# Altium schematic sheet Sheet1.SchDoc (part 2 of 2)
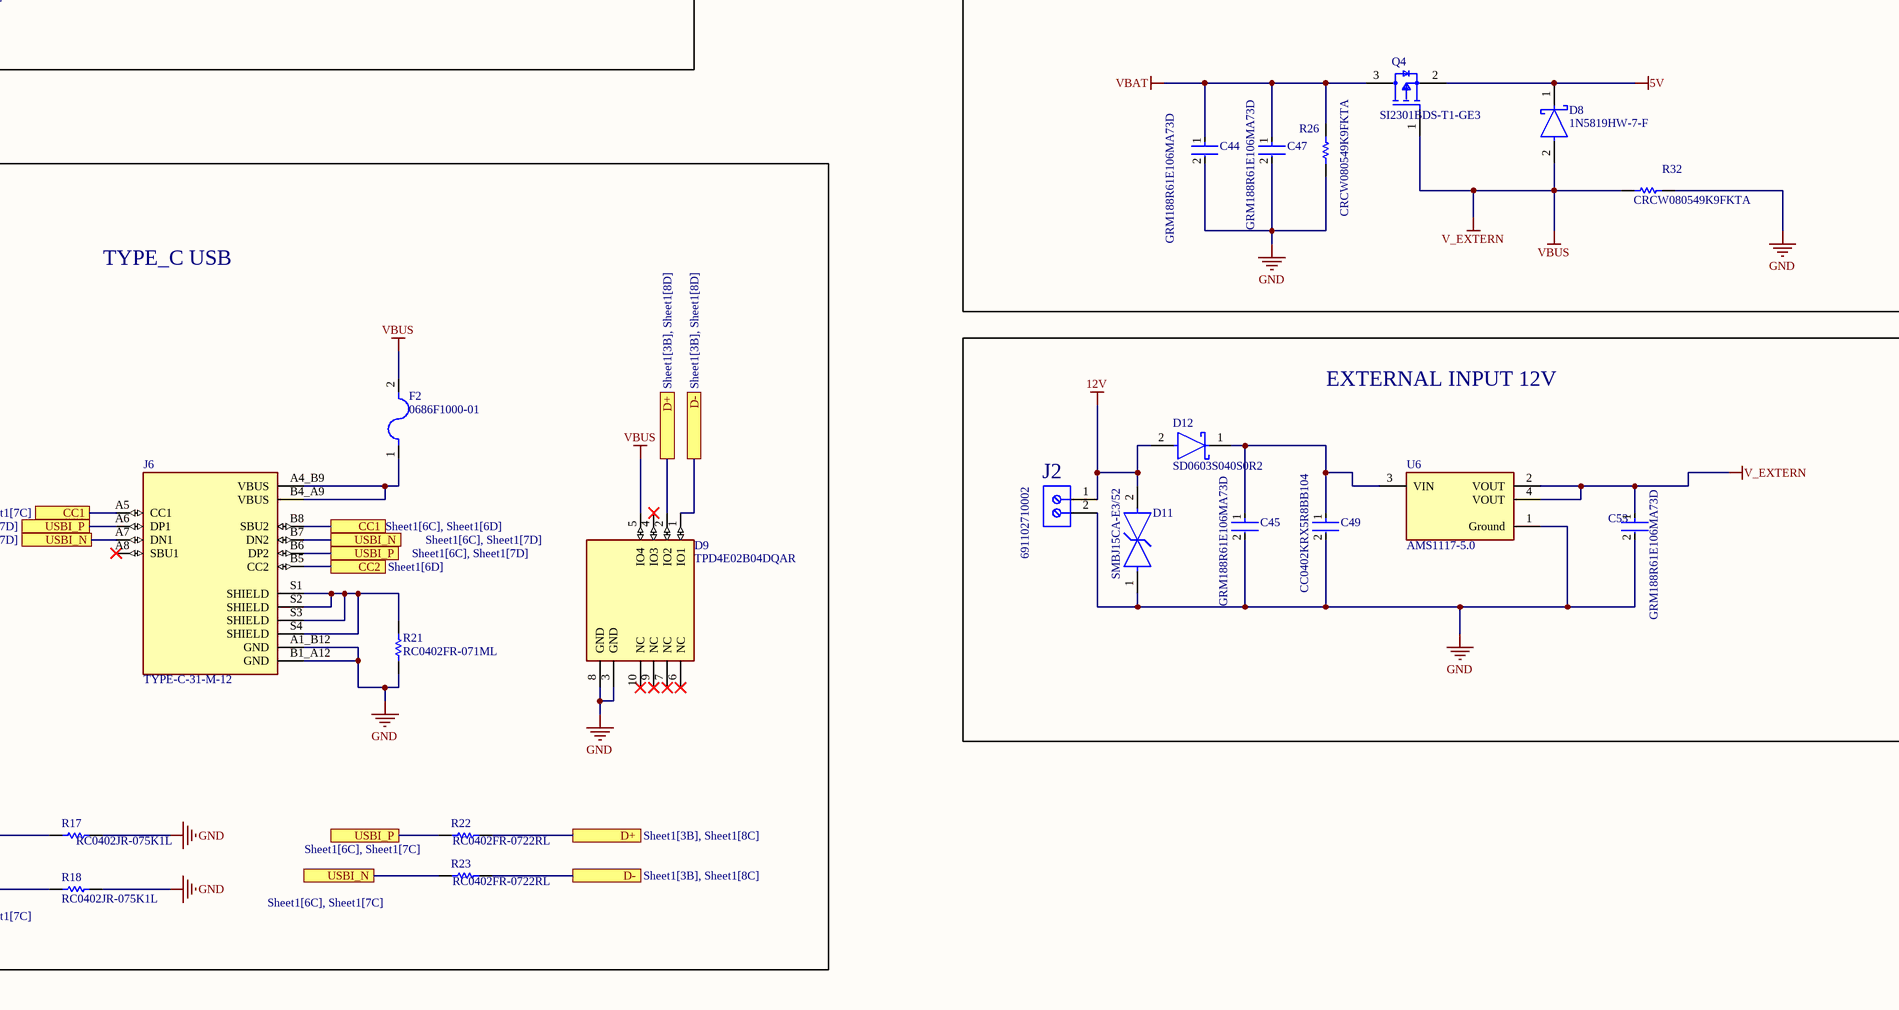
[diagram p4: Sheet1.SchDoc, bottom right]

## Library data of the parts
C1 = CMP-2008-03720-2: Ceramic Capacitor for Automotive 47nF ±10% 25VDC X7R 0402 Paper T/R; Voltage Rating: 25V; REACH SVHC: No SVHC; Width: 0.02inch; Packaging: Tape and Reel; Case Code (Metric): 1005; Radiation Hardening: No; Voltage: 25V; Length: 1mm; Capacitance: 47nF; Thickness: 0.022inch; Depth: 0.5mm; Termination: SMD/SMT; Dielectric: X7R; Case/Package: 0402; Ratings: AEC-Q200; Voltage Rating (DC): 25V; Mount: Surface Mount; Max Operating Temperature: 125°C; Package Quantity: 1; Tolerance: 10%; Min Operating Temperature: -55°C; Case Code (Imperial): 0402; Height: 0.5mm
C2 C33 = CMP-1662-00020-1: Chip Capacitor, 1 uF, +/- 10%, 6.3 V, -55 to 85 degC, 0402 (1005 Metric), RoHS, Tape and Reel; Voltage Rating (DC): 3 V; Type (Capacitors): X5R; Voltage Rating: 6.3 V; Capacitance: 1 uF; ComponentLink2Description: Datasheet; ComponentLink2URL: http://psearch.en.murata.com/capacitor/product/GRM155R60J105KE19%23.pdf; Max Operating Temperature: 85 degC; Min Operating Temperature: -55 degC; Package Quantity: 10000; Mounting Technology: Surface Mount; ComponentLink1Description: Manufacturer URL; ComponentLink1URL: http://www.murata.com/; PackageDescription: 2-Pin Surface Mount Device, Body 1 x 0.5 mm; Tolerance: 10%; Case/Package: 0402; Mount: Surface Mount; Packaging: Tape and Reel; Case Code (Metric): 1005; Radiation Hardening: No; Width: 0.5 mm; Length: 1 mm; DatasheetVersion: 08/2016; Height: 0.5 mm; PartNumber: GRM155R60J105KE19D; RoHSCompliant: true; Case Code (Imperial): 0402; REACH SVHC: No SVHC; Pins: 2
C4 = CMP-2008-03694-3: Ceramic Capacitor for Automotive 100pF ±5% 50VDC C0G 0402 Paper T/R; Voltage: 50V; Ratings: AEC-Q200; Radiation Hardening: No; Min Operating Temperature: -55°C; Capacitance: 100pF; Depth: 0.5mm; Max Operating Temperature: 125°C; Length: 1mm; Height: 0.5mm; Termination: SMD/SMT; Voltage Rating: 50V; Dielectric: C0G; Package Quantity: 10000; Case Code (Imperial): 0402; Width: 0.02inch; Case/Package: 0402; Lead Free: Lead Free; Case Code (Metric): 1005; Voltage Rating (DC): 50V; Thickness: 0.022inch; Mount: Surface Mount; Tolerance: 5%; REACH SVHC: No SVHC; Weight: 0.000212oz; Packaging: Tape and Reel
C5 = CMP-06035-013155-1: Ceramic Capacitor for Automotive 820pF ±5% 50VDC C0G 0402 Paper T/R
C8 C31 = CMP-2000-06332-1: Chip Capacitor, 10 nF, 16 V, 10%, -55 to 125 degC, 0402 (1005 Metric), RoHS, Tape and Reel; Manufacturer: Murata; Rated Voltage: 16V; Capacitance: 10000pF; Dielectric: X7R; Manufacturer URL: http://www.murata.com/; Package Description: 2-Pin Surface Mount Device, Body 1 x 0.5 mm; Case Size/Dimension: 0402; Tolerance (%): ±10%; Datasheet Version: 06/2016; Package Reference: 0402; Mounting Technology: SurfaceMount; Datasheet URL: http://psearch.en.murata.com/capacitor/product/GRM155R71C103KA01%23.pdf
C9 C13 C18 C19 C26-C30 C34 C35 C48-C50 C52 = CMP-03422-000607-1: CAP CER 0.1UF 25V X5R 0402; Manufacturer: YAGEO; Tolerance: 0.1; Value: 100 nF; Material: Ceramic; Automotive Grade: NA; Temperature Coefficient: 30ppm/°C; Height: 0.55mm; Voltage Rating: 25 V; Octopart: https://octopart.com/cc0402krx5r8bb104-yageo-20779263; Mouser Description: Multilayer Ceramic Capacitors MLCC - SMD/SMT 100nF 25V X5R 10%; Category: Cap; Lead Free: Yes; Device Class L2: Capacitors; Device Class L1: Passive Components; Digikey Description: CAP CER 0.1UF 25V X5R 0402; Device Class L3: Ceramic Capacitors; Temperature: -55°C to +125°C; Ipc Land Pattern Name: CAPC10050X50; Automotive: No; Package: CC0402; Temperature Range High: +125°C; RoHS: TRUE; ComponentLink2Description: Datasheet; Footprint Url: http://www.yageo.com/exep/pages/download/literatures/UPY-C_GEN_24.pdf; Capacitance: 100 nF; ComponentLink2URL: http://www.yageo.com/documents/recent/UPY-GP_NP0_16V-to-50V_16.pdf; Temperature Range Low: -55°C; Temperature Characteristic: X5R; Manufacturer Part Number: CC0402KRX5R8BB104
C11 C12 C15 C20 C21 = CMP-06035-003573-1: Chip Multilayer Ceramic Capacitors for General Purpose, 0402, 4.7uF, X5R, 15%, 20%, 10V; Case/Package: 0402; Voltage Rating: 10V; Min Operating Temperature: -55°C; Mount: Surface Mount; Packaging: Tape and Reel; Max Operating Temperature: 85°C; Capacitance: 4.7uF; Case Code (Metric): 1005; Case Code (Imperial): 0402; Tolerance: 20%
C14 C43 C51 = CMP-2000-06337-3: Chip Multilayer Ceramic Capacitors for General Purpose, 0603, 22uF, X5R, 15%, 20%, 10V; Tolerance: 20%; Weight: 0.000222oz; Material: Ceramic; Depth: 0.8mm; Length: 1.6mm; Termination: SMD/SMT; Capacitance: 22uF; Packaging: Tape and Reel; Width: 0.8mm; Voltage Rating: 10V; Case Code (Imperial): 0603; Mount: Surface Mount; Voltage Rating (DC): 10V; Case/Package: 0603; Thickness: 0.039inch; REACH SVHC: No SVHC; Dielectric: X5R; Height: 0.8mm; Package Quantity: 4000; Case Code (Metric): 1608; Min Operating Temperature: -55°C; Lead Free: Lead Free; Max Operating Temperature: 85°C
C16 C17 C?#1 C?#2 = CMP-2008-02740-1: Manufacturer: AVX Interconnect / Elco; Part Number: 04026A120KAT2A
C22 C23 = CMP-2008-03915-1: Manufacturer: Murata; Part Number: GRM1555C1H101JA01D
C24 C25 = CMP-2008-03799-2: Multi-Layer Ceramic Capacitor 12pF C0G  ±2% 0402 Paper T/R; Voltage Rating: 50V; Tolerance: 2%; Length: 1mm; Width: 0.5mm; Thickness: 0.022inch; Package Quantity: 10000; Lead Free: Lead Free; Mount: Surface Mount; Capacitance: 12pF; Voltage Rating (DC): 50V; Max Operating Temperature: 125°C; Termination: SMD/SMT; Depth: 0.5mm; Min Operating Temperature: -55°C; Height: 0.5mm; Case Code (Imperial): 0402; Case/Package: 0402; Case Code (Metric): 1005; Dielectric: C0G; Packaging: Tape and Reel; Radiation Hardening: No
C32 = CMP-2008-04600-1: Manufacturer: Murata; Part Number: GRM155R71C123KA01D
C36 = CMP-06035-062171-1: Ceramic Capacitor for Automotive 4pF ±0.25pF 50VDC C0G 0402 Paper T/R; Voltage Rating: 50V; Mount: Surface Mount; Min Operating Temperature: -55°C; Package Quantity: 10000; Case/Package: 0402; Case Code (Imperial): 0402; Thickness: 0.022inch; Dielectric: C0G; Length: 0.039inch; Ratings: AEC-Q200; Max Operating Temperature: 125°C; Voltage Rating (DC): 50V; Packaging: Tape and Reel; RoHS Compliant: Yes; Termination: SMD/SMT; Weight: 0.000212oz; Capacitance: 4pF; Case Code (Metric): 1005; Width: 0.02inch; Height: 0.5mm
C37 C38 = CMP-2008-04640-1: Manufacturer: Murata; Part Number: GRM155R71H122KA01D
C39 C40 = CMP-2008-03971-1: Manufacturer: Murata; Part Number: GRM1555C1E100JA01D
C41 = CMP-06035-005738-1: Ceramic Capacitor for Automotive 8pF ±0.25pF 50VDC C0G 0402 Paper T/R
C42 = CMP-2008-03956-2: Chip Multilayer Ceramic Capacitors for General Purpose, 0402, 0.47uF, X6S, 22%, 10%, 6.3V; Capacitance: 470nF; Termination: SMD/SMT; Voltage Rating (DC): 6.3V; Min Operating Temperature: -55°C; Mount: Surface Mount; Package Quantity: 10000; Max Operating Temperature: 105°C; Thickness: 0.022inch; Length: 1mm; Case Code (Imperial): 0402; Radiation Hardening: No; Lead Free: Lead Free; Voltage Rating: 6.3V; Height: 0.5mm; Depth: 0.5mm; Case Code (Metric): 1005; Packaging: Tape and Reel; Tolerance: 10%; Width: 0.02inch; Dielectric: X6S; Case/Package: 0402
C44-C47 C53 = CMP-2006-02520-2: Chip Multilayer Ceramic Capacitors for General Purpose, 0603, 10uF, X5R, 15%, 20%, 25V; Tolerance: 20%; Resistor Type: Ceramic; Voltage: 25V; Max Operating Temperature: 85°C; Min Operating Temperature: -55°C; Capacitance: 10uF; Dielectric: X5R; Lead Free: Lead Free; REACH SVHC: No SVHC; Case/Package: 0603; Mount: Surface Mount; Voltage Rating (DC): 25V; Height: 0.8mm; Length: 1.6mm; Thickness: 0.031inch; Width: 0.031inch; Termination: SMD/SMT; Case Code (Imperial): 0603; Case Code (Metric): 1608; Package Quantity: 1; Packaging: Tape and Reel; Depth: 0.8mm; Voltage Rating: 25V; Weight: 0.000222oz; Number of Pins: 2
D1 D2 D6 D7 = CMP-12791-000005-1: DIODE GEN PURP 100V 150MA SOD123; Manufacturer: Diodes Inc.; Capacitance: 2pF; Forward Current: 300mA; Max Junction Temp: +150°C; Value: 2pF; Standoff Height: 0mm; Peak Reverse Current: 1uA; Max Surge Forward Current: 1A; Category: Diode; Height: 1.45mm; ComponentLink2URL: https://upverter.com/datasheet/628e7d6fee5901eee6eef4567d1c3569f2cd3cde.pdf; Lead Free: Yes; ComponentLink2Description: Datasheet; Octopart: https://octopart.com/1n4148w-13-f-diodes+inc.-2359612; Temperature Range High: +150°C; Device Class L2: Diodes; Digikey Description: DIODE GEN PURP 100V 150MA SOD123; Reverse Voltage: 100V; Temperature Range Low: -65°C; Device Class L1: Discrete Semiconductors; Package: SOD123; RoHS: TRUE; Manufacturer Part Number: 1N4148W-13-F; Footprint Url: https://www.diodes.com/assets/Package-Files/SOD123.pdf; Automotive: No; Max Repetitive Reverse Voltage: 100V; Mouser Description: 1N4148W Series 2 A 100 V 400 mW Surface Mount Fast Switching Diode - SOD-123; Temperature: -65°C to +150°C; Device Class L3: Rectifier Diodes
D3 D10 = CMP-2000-07126-2: LED Green-Yellow  1006 SMD; Forward Current: 30mA; Lens Color: Colorless; Power Rating: 54mW; Lens Style: Diffused; Wavelength: 569nm; Viewing Angle: 150°; Lens Transparency: Clear; Number of LEDs: 1; Test Current: 1mA; Luminous Intensity: 2.1mcd; Illumination Color: Green Yellow; Forward Voltage: 1.9V; REACH SVHC: No SVHC; Mount: Surface Mount; Case Code (Imperial): 0402; Min Operating Temperature: -40°C; Max Operating Temperature: 85°C; Number of Pins: 2; Package Quantity: 1; Height: 0.25mm; Case Code (Metric): 1005; Packaging: Tape and Reel; Width: 0.6mm; Radiation Hardening: No; Case/Package: 0402; Lead Free: Lead Free; Color: Green Yellow; RoHS Compliant: Yes; Length: 1mm; Dominant Wavelength: 569nm
D4 D13 = CMP-2000-07126-2: LED Orange-red  1006 SMD; Forward Current: 30mA; Lens Color: Colorless; Power Rating: 54mW; Lens Style: Diffused; Wavelength: 569nm; Viewing Angle: 150°; Lens Transparency: Clear; Number of LEDs: 1; Test Current: 1mA; Luminous Intensity: 2.1mcd; Illumination Color: Orange Red; Forward Voltage: 1.9V; REACH SVHC: No SVHC; Mount: Surface Mount; Series: PicoLED™; Case Code (Imperial): 0402; Min Operating Temperature: -40°C; Max Operating Temperature: 85°C; Number of Pins: 2; Package Quantity: 1; Height: 0.25mm; Case Code (Metric): 1005; Packaging: Tape and Reel; Width: 0.6mm; Radiation Hardening: No; Case/Package: 0402; Lead Free: Lead Free; Color: Orange Red; RoHS Compliant: Yes; Length: 1mm; Dominant Wavelength: 569nm
D5 = CMP-2000-07126-2: LED BLUE  1006 SMD; Forward Current: 30mA; Lens Color: Colorless; Power Rating: 54mW; Lens Style: Diffused; Wavelength: 569nm; Viewing Angle: 150°; Lens Transparency: Clear; Number of LEDs: 1; Test Current: 1mA; Luminous Intensity: 2.1mcd; Forward Voltage: 1.9V; Dominant Wavelength: 465nm; REACH SVHC: No SVHC; Mount: Surface Mount; Series: PicoLED™; Case Code (Imperial): 0402; Min Operating Temperature: -40°C; Max Operating Temperature: 85°C; Number of Pins: 2; Package Quantity: 1; Height: 0.25mm; Case Code (Metric): 1005; Packaging: Tape and Reel; Width: 0.6mm; Radiation Hardening: No; Case/Package: 0402; Illumination Color: Blue; Lead Free: Lead Free; Color: Blue; RoHS Compliant: Yes; Length: 1mm
D8 = CMP-0303-00003-3: DIODE SCHOTTKY 40V 1A SOD123; Forward Voltage: 450mV; Capacitance: 110pF; Max Forward Surge Current (Ifsm): 25A; Peak Reverse Current: 50uA; Polarity: Standard; Element Configuration: Single; Max Power Dissipation: 450mW; Min Operating Temperature: -65°C; Package Quantity: 3000; Contact Plating: Tin; Weight: 0.000353oz; Max Repetitive Reverse Voltage (Vrrm): 40V; Max Reverse Voltage (DC): 40V; Height: 1.25mm; Average Rectified Current: 1A; Width: 1.7mm; Case/Package: SOD-123-2; Lead Free: Lead Free; Max Operating Temperature: 125°C; Current Rating: 1A; Termination: SMD/SMT; Forward Current: 1A; Radiation Hardening: No; Number of Pins: 2; Length: 2.85mm; Voltage Rating (DC): 40V; REACH SVHC: No SVHC; Peak Non-Repetitive Surge Current: 25A; Packaging: Tape and Reel; Output Current: 1A
D9 = CMP-04989-000015-1: TVS DIODE 3.6V 8.8V 10USON; Number of Bidirectional Channels: 4; Peak Pulse Current: 5A; Power Line Protection: No; Peak Pulse Power: 17W; Min Breakdown Voltage: 5.5V; Interface: USB; Resistor Type: Zener; Number of Pins: 10; Lead Free: Lead Free; Clamping Voltage: 8.8V; RoHS Compliant: Yes; Min Operating Temperature: -40°C; REACH SVHC: No SVHC; Max Operating Temperature: 125°C; Packaging: Cut Tape; Operating Supply Voltage: 3.6V; Reverse Standoff Voltage: 3.6V; Number of Channels: 4; Mount: Surface Mount
D11 = CMP-02577-000003-2: TVS DIODE 15V 24.4V DO214AA; Min Breakdown Voltage: 16.7V; Test Current: 1mA; Number of Channels: 1; Max Surge Current: 24.6A; Element Configuration: Single; Max Power Dissipation: 600W; Max Breakdown Voltage: 18.5V; Direction: Bidirectional; Max Reverse Leakage Current: 1uA; Max Operating Temperature: 150°C; Reverse Standoff Voltage: 15V; Min Operating Temperature: -55°C; Height: 2.24mm; Voltage Rating (DC): 15V; Operating Supply Voltage: 15V; Peak Pulse Current: 24.6A; Width: 3.94mm; Package Quantity: 750; Number of Pins: 2; Radiation Hardening: No; Breakdown Voltage: 16.7V; Case/Package: SMB; Length: 4.57mm; Power Dissipation: 600W; Clamping Voltage: 24.4V; Number of Elements: 1; Packaging: Tape and Reel; Reverse Breakdown Voltage: 16.7V; Termination: SMD/SMT; Leakage Current: 1uA; Lead Free: Lead Free; Peak Pulse Power: 600W; Polarity: Bidirectional; Mount: Surface Mount
D12 = CMP-04549-000001-1: DIODE SCHOTTKY 40V 200MA 0603; Manufacturer: AVX; Max Surge Forward Current: 2A; Forward Current: 0.2A; Lead Free: Yes; Reverse Voltage: 40V; Temperature Range Low: -55°C; Device Class L1: Discrete Semiconductors; Category: Diode; ComponentLink2URL: http://datasheets.avx.com/schottky.pdf; Device Class L3: Schottky Diodes; Automotive: No; Temperature Range High: +125°C; Digikey Description: DIODE SCHOTTKY 40V 200MA 0603; Device Class L2: Diodes; ComponentLink2Description: Datasheet; Max Repetitive Reverse Voltage: 40V; Mouser Description: Schottky Diodes & Rectifiers 40volts 0.2A SIZE 0603; Height: 0.86mm; Temperature: -55°C to +125°C; Manufacturer Part Number: SD0603S040S0R2; Package: SD0603; RoHS: TRUE; Octopart: https://octopart.com/sd0603s040s0r2-avx-24931763
D14 = CMP-2000-07126-2: LED YELLOW 1006 SMD; Forward Current: 20mA; Lens Color: Colorless; Power Rating: 54mW; Lens Style: Diffused; Wavelength: 569nm; Viewing Angle: 150°; Lens Transparency: Clear; Number of LEDs: 1; Test Current: 1mA; Luminous Intensity: 2.1mcd; Illumination Color: Green; Forward Voltage: 1.9V; REACH SVHC: No SVHC; Mount: Surface Mount; Series: PicoLED™; Case Code (Imperial): 0402; Min Operating Temperature: -40°C; Max Operating Temperature: 85°C; Number of Pins: 2; Package Quantity: 1; Height: 0.25mm; Case Code (Metric): 1005; Packaging: Tape and Reel; Width: 0.6mm; Radiation Hardening: No; Case/Package: 0402; Lead Free: Lead Free; Color: Green; RoHS Compliant: Yes; Length: 1mm; Dominant Wavelength: 569nm
F1 F2 = 0686F1000-01: 0603 SMT Fuse | Fast Acting | 1A; MF: Bel Fuse; Mouser-Purchase-URL: https://snapeda.com/shop?store=Mouser&id=4616119; SnapEDA_Link: https://www.snapeda.com/parts/0686F1000-01/Bel%20Fuse/view-part/4616119/?ref=snap; Package: 0603 Bel Fuse Inc.; Price: None; MP: 0686F1000-01; Availability: Unavailable; Value: *
FB1-FB4 = CMP-0686-00181-5: Chip Ferrite Bead, 0402, 1000Ω @ 100MHz, 0.65Ω, 25%, 300mA; DC Current: 200mA; Number of Circuits: 1; Shielding: Unshielded; Impedance: 1kR; DC Resistance (DCR): 650mR; DC Resistance-Max: 1R; Packaging: Tape and Reel; Case Code (Imperial): 0402; Military Standard: Not; Min Operating Temperature: -55°C; Width: 0.5mm; Tolerance: 25%; Material: Ferrite; Number of Lines: 1; Max Current Rating: 300mA; Depth: 0.55mm; Package Quantity: 1; Case/Package: 0402; Series: BLM15AG_SN; Case Code (Metric): 1005; Max Operating Temperature: 125°C; Lead Free: Lead Free; Test Frequency: 100MHz; RoHS Compliant: Yes; Radiation Hardening: No; Number of Pins: 2; Core Material: Ferrite; Current Rating: 300mA; Frequency: 100MHz; Max DC Current: 200mA; REACH SVHC: No SVHC; Length: 1mm; Termination: SMD/SMT; Height: 0.5mm
J1 = TP4057: <b>500mA linear li-ion battery charger</b><p> tp4057 actual charge current to 500ma, dual-lamp indication, reverse battery protection.<br> Alternative to MAX1551 or MAX1555 (not compatible!)<p> Datasheet from TP micro: <br> http://www.tpmicro.com/datasheet/TP4057Ver1.0_preview.pdf <br> http://www.tp-asic.com/te_product_a/2009-05-20/33.chtml; MF: toppower; SnapEDA_Link: https://www.snapeda.com/parts/TP4057/Top+Power/view-part/?ref=snap; Package: None; MP: TP4057; Check_prices: https://www.snapeda.com/parts/TP4057/Top+Power/view-part/?ref=eda; Price: None; Value: *; Availability: Not in stock
J2 = CMP-1502-03258-2: NexarPartId: 8917706; Number of Levels: 1; Number of Positions Per Level: 2; Current: 15A; Voltage: 300V; Pitch: 5.0038mm; Plating: Steel; Stripping Length: -6mm; Wire Gauge (Min): 14AWG; Wire Gauge (Max): 22AWG; Length: 7.5mm; Contact Material: Brass; Contact Plating: Tin; Packaging: Box; Number of Pins: 2; Voltage Rating: 300V; Termination: Screw; Number of Contacts: 2; Color: Blue; Current Rating: 15A; Mount: Through Hole; Max Operating Temperature: 105°C; Min Operating Temperature: -40°C; REACH SVHC: Unknown; Height: 13.4mm; Width: 11.2mm; Housing Material: Nylon; RoHS: Compliant; Wire/Cable Gauge: 22AWG; Lead Pitch: 5mm
J3 J4 = CMP-2000-05152-3: CONN U.FL RCPT STR 50 OHM SMD; Max Frequency: 6GHz; Connector Type: Coaxial; Body Plating: Silver; Body Material: Bronze; Impedance: 50R; Dielectric Material: Polymer; Insulation Resistance: 500MR; Gender: Male; Packaging: Cut Tape; Length: 3mm; Package Quantity: 2500; Termination: Solder; Lead Free: Lead Free; Series: U.FL; Min Operating Temperature: -40°C; Fastening Type: Snap; Contact Material: Brass; Orientation: Straight; Wire/Cable Type: Coaxial; Frequency: 6GHz; Contact Plating: Gold; Depth: 3.1mm; Weight: 0.001764oz; Max Operating Temperature: 90°C; Radiation Hardening: No; REACH SVHC: No SVHC; Mount: Surface Mount; Housing Color: Beige
J6 = TYPE-C-31-M-12: USB Connectors 24 Receptacle 1 8.94*7.3mm RoHS; MF: HRO Electronics Co., Ltd.; Price: None; Value: *; SnapEDA_Link: https://www.snapeda.com/parts/TYPE-C-31-M-12/HRO+Electronics+Co.%252C+Ltd./view-part/?ref=snap; Package: Package; Availability: Not in stock; Check_prices: https://www.snapeda.com/parts/TYPE-C-31-M-12/HRO+Electronics+Co.%252C+Ltd./view-part/?ref=eda; MP: TYPE-C-31-M-12
L1 L2 = CMP-06042-016407-1: FIXED IND 10UH 50MA 900 MOHM SMD; Self Resonant Frequency: 30MHz; Tolerance: 20%; DC Resistance (DCR): 1.17R; Core Material: Ferrite; Shielding: Shielded; Test Frequency: 1MHz; Packaging: Tape and Reel; Max DC Current: 50mA; Depth: 0.9mm; DC Current: 50mA; Case/Package: 0603; Saturation Current: 50mA; Height - Seated (Max): 0.035inch; Package Quantity: 4000; Case Code (Metric): 1608; RoHS Compliant: Yes; Military Standard: Not; Current Rating: 50mA; Max Operating Temperature: 125°C; Height: 0.9mm; Inductance: 10uH; Series: LQM18F; Radiation Hardening: No; Lead Free: Lead Free; Termination: SMD/SMT; Length: 0.063inch; Mount: Surface Mount; Case Code (Imperial): 0603; Width: 0.031inch; Min Operating Temperature: -55°C
L3 L7 L10 = CMP-06042-009484-1: Multilayer type Inductor for Automotive 15nH ±3% 0.32Ω 450mA 0402; Core Material: Air; Self Resonant Frequency: 2.5GHz; Test Frequency: 100MHz; DC Resistance (DCR): 320mR; Shielding: Unshielded; Packaging: Cut Tape; Mount: Surface Mount; Min Operating Temperature: -55°C; Case/Package: 0402; Tolerance: 3%; Ratings: AEC-Q200; Max Operating Temperature: 125°C; Case Code (Imperial): 0402; Case Code (Metric): 1005; Current Rating: 450mA; Inductance: 15nH
L4 = CMP-14484-001405-1: 250mA 100nH ±10% 300mΩ 0805; Current Rating: 295mA; Tolerance: 20%; Self Resonant Frequency: 45MHz; Test Frequency: 7.96MHz; DC Resistance (DCR): 500mR; Core Material: Ferrite; Shielding: Unshielded; Inductance: 4.7uH; Resistor Type: Wirewound; Halogen Free: Halogen Free; Radiation Hardening: No; Inductance Tolerance: 20%; Case/Package: 0805; Mount: Surface Mount; Length: 0.079inch; Max DC Current: 295mA; Military Standard: Not; Lead Pitch: 1mm; DC Current: 295mA; Height - Seated (Max): 0.057inch; Case Code (Imperial): 0805; Height: 1.25mm; Package Quantity: 3000; RoHS Compliant: Yes; Number of Pins: 2; Lead Free: Lead Free; Case Code (Metric): 2012; Max Operating Temperature: 105°C; Min Operating Temperature: -40°C; Series: LB; Packaging: Tape and Reel; Width: 0.049inch; Weight: 0.000194oz; Termination: SMD/SMT; Depth: 1.45mm
L6 L9 = CMP-08253-000227-1: Shielded Multilayer Inductor 2.2uH ±20% 1000mA 212.5mΩ SMD 0806; DC Resistance (DCR): 212.5mR; Test Frequency: 2MHz; Current Rating: 1A; Core Material: Ferrite; Case/Package: 0806; Case Code (Metric): 2016; Packaging: Cut Tape; Package Quantity: 3000; Length: 0.079inch; Width: 0.063inch; Tolerance: 20%; Case Code (Imperial): 0806; Min Operating Temperature: -40°C; Shielding: Shielded; Max Operating Temperature: 125°C; Inductance: 2.2uH; RoHS Compliant: Yes; Mount: Surface Mount; Height - Seated (Max): 0.039inch; Lead Free: Lead Free
L8 = CMP-06042-010497-1: Film type RF Inductor 4nH ±0.1nH 350mA 0.4Ω 0201 (0603); Test Frequency: 500MHz; DC Resistance (DCR): 400mR; Shielding: Unshielded; Self Resonant Frequency: 5.3GHz; Core Material: Non-Magnetic; Packaging: Tape and Reel; Width: 0.012inch; Max Operating Temperature: 125°C; Package Quantity: 15000; Case Code (Metric): 0603; Mount: Surface Mount; Min Operating Temperature: -55°C; Height - Seated (Max): 0.013inch; Case Code (Imperial): 0201; Case/Package: 0201; Military Standard: Not; Length: 0.024inch; Resistor Type: Thin Film; DC Current: 350mA; Inductance: 4nH; Current Rating: 350mA; Depth: 0.33mm
L11 = CMP-06042-003301-1: Multilayer type Inductor for Automotive 47nH ±5% 0.72Ω 300mA 0402; Max DC Current: 200mA; Core Material: Air; Q Factor: 8; Test Frequency: 100MHz; Self Resonant Frequency: 1GHz; Shielding: Unshielded; DC Resistance (DCR): 720mR; Min Operating Temperature: -55°C; Package Quantity: 10000; Packaging: Tape and Reel; Case/Package: 0402; Height - Seated (Max): 0.022inch; Tolerance: 5%; Max Operating Temperature: 125°C; Mount: Surface Mount; Height: 0.5mm; Termination: SMD/SMT; Length: 0.039inch; Case Code (Metric): 1005; Current Rating: 200mA; Inductance: 47nH; Case Code (Imperial): 0402; Width: 0.02inch
P1 P2 = CMP-1502-01064-2: NexarPartId: 32855522; Pitch: 2.54mm; Number of Contacts: 4; Contact Resistance: 20mΩ; Gender: Male; Current Rating: 3A; Connector Type: Male Pin; Voltage Rating: 250V; Lead Free: Lead Free; Contact Plating: Gold; Max Operating Temperature: 105°C; Packaging: Bulk; Height: 8.89mm; Orientation: Vertical; Contact Mating Length: 5.9944mm; Contact Material: Copper; Lead Pitch: 2.54mm; Min Operating Temperature: -40°C; Termination: Solder; Color: Black; Number of Rows: 1; REACH SVHC: Unknown; RoHS: Compliant; Mount: Through Hole; Number of Positions: 4; Number of Pins: 4; Operating Supply Voltage: 250V
P3 = CMP-1755-00004-1: Male Header, Pitch 2 mm, 1 x 2 Position, Height 4.8 mm, Tail Length 3.4 mm, -25 to 85 degC, RoHS, Bulk; Case\Package: Radial; Tolerance: 20%; Capacitance: 10 uF; Voltage Rating (DC): 50 V; Packaging: Bulk; ComponentLink1URL: http://www.jst-mfg.com/product/pdf/eng/ePH.pdf; Radiation Hardening: No; Height: 11 mm; Package Quantity: 200; PackageDescription: Male Header, Pitch 2 mm, 1 x 2 Position, Height 4.8 mm, Tail Length 3.4 mm; PackageReference: S2B-PH-K-S; Diameter: 5 mm; Pins: 2; Mount: Through Hole; Max Operating Temperature: 85 degC; Min Operating Temperature: -40 degC; ComponentLink1Description: Datasheet; DatasheetVersion: Dec-12; Length: 11 mm; Lead Pitch: 2 mm; REACH SVHC: No SVHC; Voltage Rating: 50 V; RoHSCompliant: true
Q1 = CMP-14406-000022-1: TRANS NPN 40V 0.2A 3DFN
Q2-Q4 = CMP-00030-42864886-1: SI2301BDS-T1-GE3 Trans Mosfet P-ch Si 20V 2.2A 3-PIN SOT-23 T/r / Mosfet P-ch 20V 2.2A SOT23-3; Rise Time: 40ns; Nominal Vgs: -950mV; Gate to Source Voltage (Vgs): 8V; Element Configuration: Single; Number of Channels: 1; Power Dissipation: 700mW; Resistance: 100MΩ; Continuous Drain Current (ID): -2.2A; Drain to Source Breakdown Voltage: -20V; Turn-On Delay Time: 20ns; Turn-Off Delay Time: 30ns; Input Capacitance: 375pF; Schedule B: 8541210080, 8541210080; Length: 3.04mm; Height: 1.02mm; Radiation Hardening: No; RoHS: Compliant; NexarPartId: 42864886; Number of Pins: 3; Weight: 1.437803g; Mount: Surface Mount; Min Operating Temperature: -55°C; Number of Elements: 1; Drain to Source Resistance: 100mΩ; Max Power Dissipation: 700mW; Threshold Voltage: -950mV; Lead Free: Lead Free; Rds On Max: 100mΩ; Width: 1.4mm; REACH SVHC: Unknown; Fall Time: 40ns; Max Operating Temperature: 150°C; Drain to Source Voltage (Vdss): -20V; Case/Package: SOT-23-3
R1 R2 R9 R10 R13 R24-R27 R32 = CMP-2001-03953-1: Manufacturer: Vishay Dale; Part Number: CRCW080549K9FKTA
R3-R5 R29 = CMP-2002-07985-1: Part Number: RC0402JR-07330RL; Manufacturer: Yageo / Phycomp
R6 R19 R20 = CMP-2000-04815-2: RES SMD 0 OHM JUMPER 1/10W 0603; Power Rating: 100mW; Tolerance: 1%; Voltage Rating: 50V; Resistance: 0R; Temperature Coefficient: 200ppm/°C; Min Operating Temperature: -55°C; Case Code (Imperial): 0603; Size Code: 0603; Termination: SMD/SMT; Lead Free: Lead Free; Package Quantity: 1; Max Power Dissipation: 100mW; Packaging: Tape and Reel; Series: AC; Case Code (Metric): 1608; Height: 0.022inch; Length: 0.063inch; Case/Package: 0603; Resistor Type: Thick Film; Max Operating Temperature: 155°C; Features: Moisture Resistant; Width: 0.031inch; Number of Terminations: 2
R7 R8 R11 R12 = CMP-2002-01759-2: RES 100Ω ±5% 0.063W 0402; Voltage Rating: 50V; Power Rating: 62.5mW; Temperature Coefficient: 100ppm/°C; Max Power Dissipation: 63mW; Resistance: 100R; Width: 0.5mm; Height: 0.015inch; Termination: SMD/SMT; Weight: 2.3E-05oz; Tolerance: 5%; Features: Moisture Resistant; Construction: Rectangular; Case/Package: 0402; Case Code (Imperial): 0402; Resistor Type: Thick Film; Case Code (Metric): 1005; Number of Terminations: 2; Min Operating Temperature: -55°C; Depth: 0.5mm; Military Standard: Not; Packaging: Tape and Reel; RoHS Compliant: Yes; Length: 1mm; Max Operating Temperature: 155°C; Series: AC
R14 = CMP-03412-047392-1: Anti-Sulfurated Chip Resistors Automotive Grade 1kΩ 5% 100ppm/°C 0402; Power Rating: 62.5mW; Voltage Rating: 50V; Resistance: 1kR; Max Power Dissipation: 63mW; Features: Moisture Resistant; Series: AF; Packaging: Tape and Reel; RoHS Compliant: Yes; Tolerance: 5%; Case Code (Metric): 1005; Resistor Type: Thick Film; Height: 0.015inch; Width: 0.5mm; Termination: SMD/SMT; Min Operating Temperature: -55°C; Temperature Coefficient: 100ppm/°C; Weight: 2.3E-05oz; Max Operating Temperature: 155°C; Length: 0.039inch; Number of Terminations: 2; Case/Package: 0402; Case Code (Imperial): 0402; Package Quantity: 10000
R15 R16 = CMP-2002-07344-1: Manufacturer: Yageo / Phycomp; Part Number: RC0402FR-07100RL
R17 R18 = CMP-2002-08025-1: Manufacturer: Yageo / Phycomp; Part Number: RC0402JR-075K1L
R21 = CMP-2002-07490-1: Manufacturer: Yageo / Phycomp; Part Number: RC0402FR-071ML
R22 R23 = CMP-2002-07520-1: Manufacturer: Yageo / Phycomp; Part Number: RC0402FR-0722RL
R28 = CMP-2002-01782-2: RES 1kΩ ±5% 0.063W 0402; Temperature Coefficient: 100ppm/°C; Voltage Rating: 50V; Power Rating: 62.5mW; Resistance: 1kR; Max Power Dissipation: 63mW; Termination: SMD/SMT; Series: AC; Features: Moisture Resistant; Lead Free: Lead Free; Height: 0.015inch; Tolerance: 5%; Case/Package: 0402; Case Code (Imperial): 0402; Length: 0.039inch; Resistor Type: Thick Film; Width: 0.5mm; Case Code (Metric): 1005; Number of Terminations: 2; Max Operating Temperature: 155°C; Weight: 2.3E-05oz; Min Operating Temperature: -55°C; RoHS Compliant: Yes; Packaging: Tape and Reel
R30 = CMP-2002-07985-1: Manufacturer: Yageo / Phycomp; Part Number: RC0402JR-07330RL
R31 = CMP-2002-01790-3: RES 10kΩ ±1% 0.063W 0402; Power Rating: 62.5mW; Voltage Rating: 50V; Temperature Coefficient: 100ppm/°C; Resistance: 10kR; Max Power Dissipation: 63mW; Tolerance: 1%; Military Standard: Not; Construction: Rectangular; Termination: SMD/SMT; Max Operating Temperature: 155°C; Min Operating Temperature: -55°C; Height: 0.015inch; Lead Free: Lead Free; Width: 0.02inch; Case/Package: 0402; Resistor Type: Thick Film; Series: AC; Features: Moisture Resistant; RoHS Compliant: Yes; Number of Terminations: 2; Case Code (Metric): 1005; Length: 0.039inch; Depth: 0.5mm; Size Code: 0402; Packaging: Tape and Reel; Case Code (Imperial): 0402
SW1 SW2 = CMP-1696-00003-1: Switch, Tactile, SPST-NO, 50 mA, 12 V, 4-Pin SMD, RoHS, Tape and Reel; Voltage Rating (DC): 50 V; Tolerance: 20%; Case\Package: Radial; Capacitance: 4.7 uF; Max Operating Temperature: 85 degC; REACH SVHC: No SVHC; Package Quantity: 200; Voltage Rating: 50 V; ComponentLink1Description: Manufacturer URL; ComponentLink2URL: http://spec_sheets.e-switch.com/specs/P010632.pdf; ComponentLink2Description: Datasheet; Height: 11 mm; Lead Pitch: 2 mm; RoHSCompliant: true; Radiation Hardening: No; Pins: 2; Length: 11 mm; DatasheetVersion: Rev. I, 12/2010; PackageReference: TL3342F160QG; ComponentLink1URL: http://www.e-switch.ch/en/; PackageDescription: 4-Pin Surface Mount Device, Body 5 x 5 mm, Pitch 6.3 mm; Mount: Through Hole; Diameter: 5 mm; Packaging: Bulk; Min Operating Temperature: -40 degC; Width: 0 inch
U = W25Q32JVSSIQ: FLASH - NOR Memory IC 32Mb _4M x 8_ SPI - Quad I/O 133MHz 8-SOIC; MF: Winbond; Price: None; SnapEDA_Link: https://www.snapeda.com/parts/W25Q32JVSSIQ/Winbond%20Electronics/view-part/596953/?ref=snap; Availability: Unavailable; Value: *; MP: W25Q32JVSSIQ
U1 = SX1262IMLTRT: IC RF TxRx Only General ISM < 1GHz LoRaWAN 150MHz ~ 960MHz 24-VFQFN Exposed Pad; MF: Semtech Corporation; Value: *; SnapEDA_Link: https://www.snapeda.com/parts/SX1262IMLTRT/Semtech%20Corporation/view-part/2781045/?ref=snap; Availability: Unavailable; Package: VFQFN-24 Semtech; Price: None; MP: SX1262IMLTRT
U2 = NRF52840-QIAA-R: IC RF TxRx + MCU 802.15.4, Bluetooth Bluetooth v5.0, Thread, ZigbeeÂ® 2.4GHz 73-VFQFN Dual Rows, Exposed Pad; MF: Nordic; Package: VFQFN-73 Nordic; Price: None; Check_prices: https://www.snapeda.com/parts/NRF52840-QIAA-R/Nordic+Semiconductor+ASA/view-part/?ref=eda; Value: *; SnapEDA_Link: https://www.snapeda.com/parts/NRF52840-QIAA-R/Nordic+Semiconductor+ASA/view-part/?ref=snap; MP: NRF52840-QIAA-R; Availability: In Stock; Purchase-URL: https://pricing.snapeda.com/search?q=NRF52840-QIAA-R&ref=eda
U3 = CMP-12756-000035-1: IC REG LINEAR 3.3V 600MA SOT25; Number of Regulators: 1; Output Type: Fixed; Polarity: Positive; Min Input Voltage: 2.5V; Max Input Voltage: 6V; Accuracy: 1.5%; Quiescent Current: 55uA; Dropout Voltage: 250mV; Min Operating Temperature: -40°C; Length: 3.1mm; Output Current: 600mA; Max Operating Temperature: 85°C; Package Quantity: 1; Output Voltage: 3.3V; Width: 1.7mm; Number of Outputs: 1; Packaging: Tape and Reel; Height: 1.3mm; Lead Free: Lead Free; Max Output Current: 600mA; Case/Package: SOT-23-5; Mount: Surface Mount; Number of Pins: 5
U4 = L76: L76, the extremely compact GNSS module, is a concurrent GNSS receiver with multiple GNSS systems. It provides simultaneous GPS, GLONASS, BeiDou, Galileo and QZSS open service L1 reception capability.; MF: Quectel; Availability: In Stock; Check_prices: https://www.snapeda.com/parts/L76/Quectel/view-part/?ref=eda; SnapEDA_Link: https://www.snapeda.com/parts/L76/Quectel/view-part/?ref=snap; Value: *; Price: None; Purchase-URL: https://pricing.snapeda.com/search/part/L76/?ref=eda; Package: Custom Quectel; MP: L76
U5 = CMP-2000-05298-1: IC RF Switch SPDT, 50 Ohm, 6-Pin SC70, RoHS, Tape and Reel; Manufacturer: Peregrine Semiconductor; P1dB: 29dBm(typ)IP1dB; Topology: Reflective; Frequency - Upper: 3GHz; Insertion Loss @ Frequency: 0.5dB@2GHz; IIP3: 55dBm(typ); Voltage - Supply: 1.8V~3.3V; Other Names: 1046-1011-24259-63-ND425963PE4259PE4259SCBC-ZPE4259SCBC-Z-ND; Isolation @ Frequency: 20dB@2GHz(typ); Frequency - Lower: 10MHz; Online Catalog: PE4259; Impedance: 50Ohm; RF Type: GeneralPurpose; Series: UltraCMOS; Manufacturer URL: http://www.psemi.com/; Package Description: 6-Pin Small Outline Transistor, Body 2.05 x 1.25 mm, Pitch 0.65 mm; Family: RFSwitches; Packaging: Tape&Reel(TR); Features: Single/DualLineControl; Package / Case: 6-TSSOP,SC-88,SOT-363; Operating Temperature: -40degC~85degC; Circuit: SPDT; Supplier Device Package: SC-70-6; Standard Package: 3,000; Datasheet URL: https://datasheet.ciiva.com/15100/getdatasheetpartid-685660-15100501.pdf; Category: RF/IFandRFID; Datasheet Version: Jan-11; Package Reference: SC-70-6
U6 = CMP-209535-000001-1: LDO Voltage Regulators 1A, 3.3V; Manufacturer Part Number: AMS1117-3.3; Manufacturer: Advanced Monolithic Systems; Dropout Voltage: 1.1V; Output Type: Fixed; Nominal Supply Current: 5mA; Max Power Dissipation: 1.2W; Max Supply Voltage: 15V; Number Of Outputs: 1; Standoff Height: 0.64mm; Max Junction Temp: +125°C; Height: 1.8mm; Package: AMS1117; Device Class L2: Power Management ICs; ComponentLink2Description: Datasheet; ComponentLink2URL: http://www.advanced-monolithic.com/pdf/ds1117.pdf; Category: IC; RoHS: TRUE; Automotive: No; Device Class L1: Integrated Circuits (ICs); Output Current: 1A; Device Class L3: Voltage Regulators - Linear; Temperature: -40°C to +125°C; Output Voltage: 3.3V; Temperature Range Low: -40°C; Octopart: https://octopart.com/ams1117-3.3-advanced+monolithic+systems-25899300; Lead Free: Yes; Ipc Land Pattern Name: SOT229P700X180-4; Temperature Range High: +125°C
Y1 Y2 = CMP-27762-014975-1: Crystal 32MHz ±30ppm (Tol) ±30ppm (Stability) 10pF FUND 50Ω 4-Pin SMD T/R; ESR (Equivalent Series Resistance): 50R; Depth: 2.5mm; Frequency: 32MHz; Min Operating Temperature: -20°C; Lead Free: Lead Free; Termination: SMD/SMT; Load Capacitance: 10pF; Mount: Surface Mount; Max Operating Temperature: 70°C; Frequency Stability: 30ppm; Series: ABM8G; Tolerance: 30ppm; Width: 2.5mm; Packaging: Tape and Reel; Frequency Tolerance: 30ppm; Package Quantity: 1000; Series Resistance: 50R; Number of Pins: 4; Length: 3.2mm; Case/Package: CSMD; Height: 1mm
Y3 = CMP-2000-05037-2: CRYSTAL 32.7680KHZ 12.5PF SMD; ESR (Equivalent Series Resistance): 50kR; Tolerance: 20ppm; Width: 3.8mm; REACH SVHC: No SVHC; Load Capacitance: 12.5pF; Case/Package: SMD/SMT; Radiation Hardening: No; Series: ABS25; Number of Pins: 4; Mount: Surface Mount; RoHS Compliant: Yes; Packaging: Tape and Reel; Termination: SMD/SMT; Frequency Tolerance: 20ppm; Lead Free: Lead Free; Package Quantity: 1000; Min Operating Temperature: -40°C; Height: 0.098inch; Length: 8mm; Frequency: 32.768kHz; Max Operating Temperature: 85°C; Series Resistance: 50kR; Operating Frequency: 32.768 kHz; Depth: 3.8mm